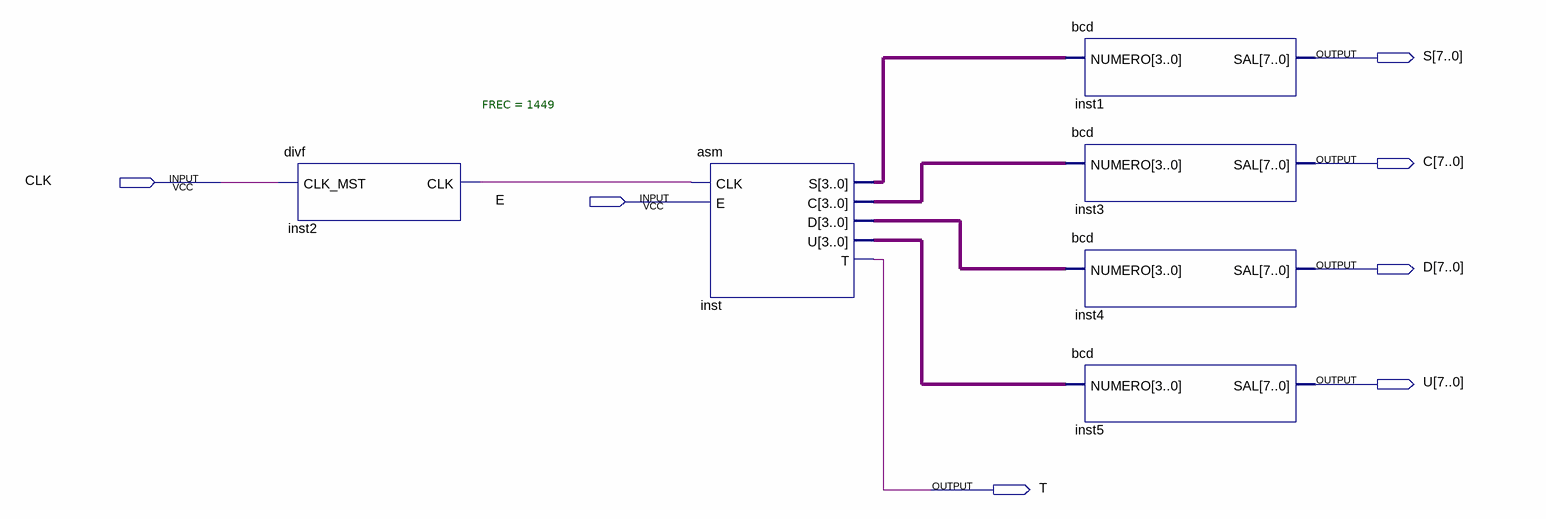
[diagram p0: schematic sheet]
// Quartus schematic Block1.bdf as structural Verilog: 6 symbols, 7 pins
module Block1 (
  input  CLK,
  input  E,
  output [7:0] S,
  output [7:0] C,
  output [7:0] D,
  output [7:0] U,
  output T
);

  wire inst2_clk;
  wire [3:0] inst_c, inst_d, inst_s, inst_u;

  divf #(.FREC(1449)) inst2 (.CLK_MST(CLK), .CLK(inst2_clk));
  asm inst (.CLK(inst2_clk), .E(E), .S(inst_s), .C(inst_c), .D(inst_d), .U(inst_u), .T(T));
  bcd inst1 (.NUMERO(inst_s), .SAL(S));
  bcd inst3 (.NUMERO(inst_c), .SAL(C));
  bcd inst4 (.NUMERO(inst_d), .SAL(D));
  bcd inst5 (.NUMERO(inst_u), .SAL(U));
endmodule
